# EAGLE design Adafruit MAX9814 (EAGLE 6.3)
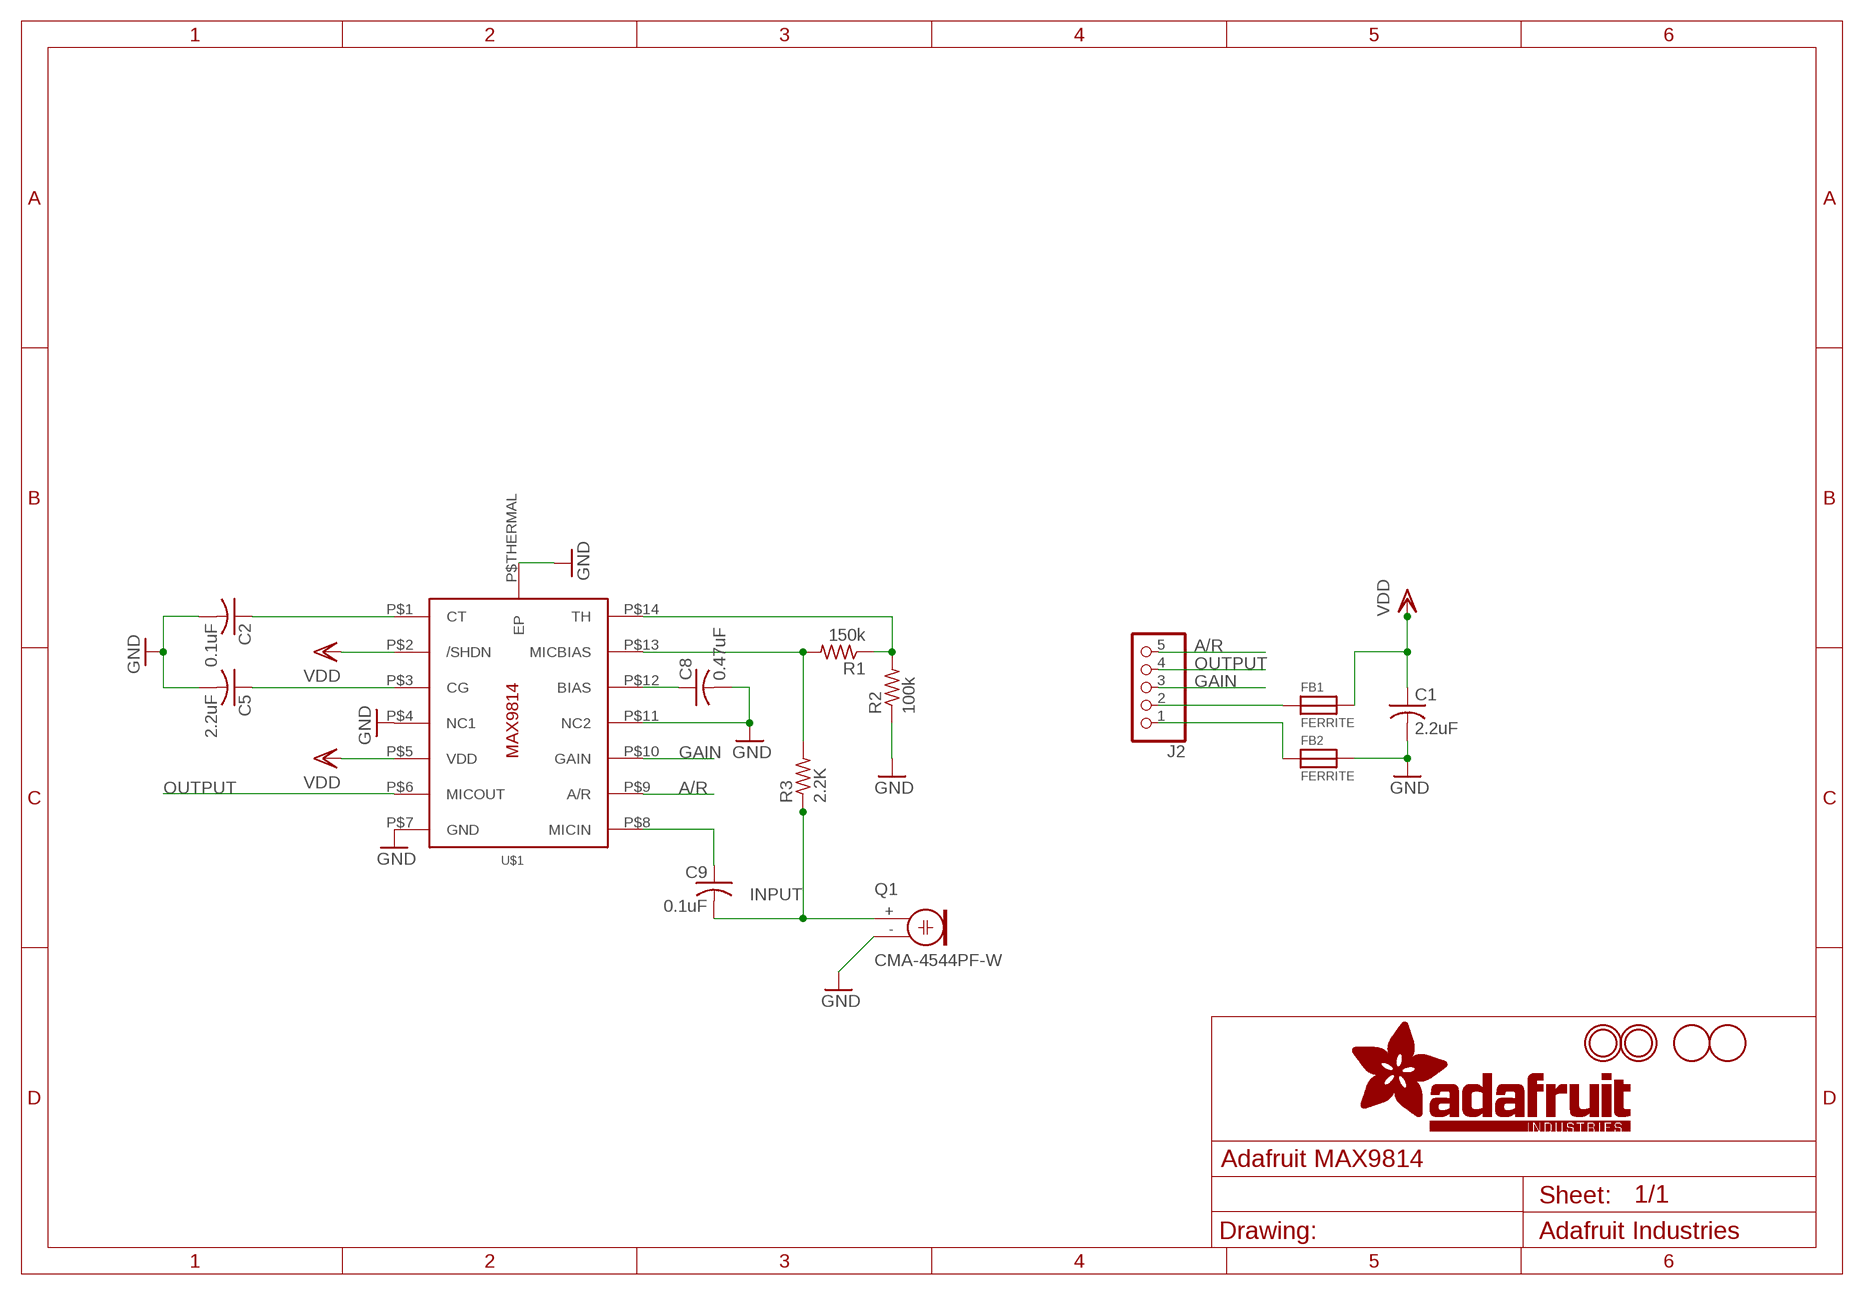
[diagram p0: schematic, sheet 1]

## Parts
C1  2.2uF  C-USC0805K  [C0805K]
C2  0.1uF  C-USC0805K  [C0805K]
C5  2.2uF  C-USC0805K  [C0805K]
C8  0.47uF  C-USC0805K  [C0805K]
C9  0.1uF  C-USC0805K  [C0805K]
FB1  FERRITE  FERRITE0805  [0805]
FB2  FERRITE  FERRITE0805  [0805]
J2  HEADER-1X576MIL  [1X05_ROUND_76]
Q1  CMA-4544PF-W  ELECTRET  [9.7ELECTRET]
R1  150k  R-US_R0805  [R0805]
R2  100k  R-US_R0805  [R0805]
R3  2.2K  R-US_R0805  [R0805]
U$1  MAX9814TDFN14  [TDFN14_3X3MM]
U$2  FIDUCIAL  [FIDUCIAL_1MM]
U$3  FIDUCIAL  [FIDUCIAL_1MM]
U$4  MOUNTINGHOLE2.0  [MOUNTINGHOLE_2.0_PLATED]
U$5  MOUNTINGHOLE2.0  [MOUNTINGHOLE_2.0_PLATED]

## Nets
A/R: J2.5 U$1.P$9(A/R)
GAIN: J2.3 U$1.P$10(GAIN)
GND: C1.2 C2.2 C5.2 C8.2 FB2.2 Q1.- R2.1 U$1.P$4(NC1) U$1.P$7(GND) U$1.P$11(NC2) U$1.P$THERMAL(EP)
INPUT: C9.2 Q1.+ R3.1
N$2: FB1.1 J2.2
N$3: FB2.1 J2.1
N$5: C9.1 U$1.P$8(MICIN)
N$7: C8.1 U$1.P$12(BIAS)
N$8: C2.1 U$1.P$1(CT)
N$9: C5.1 U$1.P$3(CG)
N$10: R1.1 R2.2 U$1.P$14(TH)
N$11: R1.2 R3.2 U$1.P$13(MICBIAS)
OUTPUT: J2.4 U$1.P$6(MICOUT)
VDD: C1.1 FB1.2 U$1.P$2(/SHDN) U$1.P$5(VDD)

## Library data of the parts
C1 C2 C5 C8 C9 = adafruit:C-US: CAPACITOR, American symbol
FB1 FB2 = microbuilder:FERRITE: Ferrite Bead 0603 MMZ1608B121C - 120 Ohm, 600mA Ferrite Chip - Digikey: 445-2164-1-ND BK1608HW121-T - 120 Ohm, 600mA Ferrite Chip - Digikey: 587-1876-2-ND
J2 = microbuilder:HEADER-1X5: PIN HEADER
Q1 = adafruit:ELECTRET: Electret microphone Thru hole 2.54mm spacing with 9.7mm diameter
R1-R3 = adafruit:R-US_: RESISTOR, American symbol
U$1 = adafruit:MAX9814
U$2 U$3 = adafruit:FIDUCIAL: For use by pick and place machines to calibrate the vision/machine, 1mm By microbuilder.eu
U$4 U$5 = microbuilder:MOUNTINGHOLE: Mounting Hole For #2 screws (0.086"/2.18mm width, 0.094"/2.4mm hole) use 2.5mm

## Board
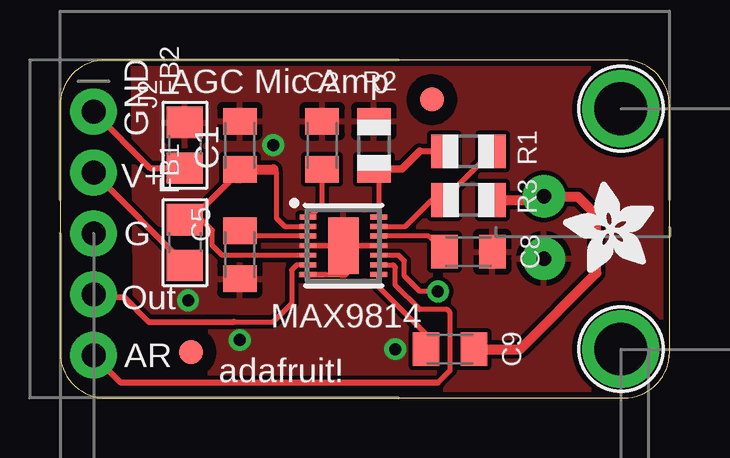
[diagram p1: board, top side]
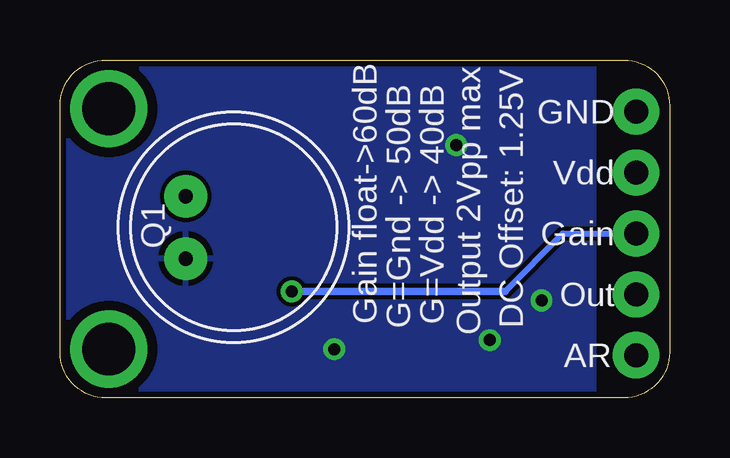
[diagram p2: board, bottom side, seen from below]

Size 25.4 x 14.1 mm. Coordinates in mm from the lower left corner, seen from the top.
Outline: 0,12.19 0,1.91 arc90 1.91,0 23.5,0 arc90 25.4,1.91 25.4,12.19 arc90 23.5,14.1 1.91,14.1 arc90 0,12.19
Copper layers (1*16): Top 0.035mm / dielectric 1.5mm / Bottom 0.035mm
Design rules "adafruit *": minimum track width 8mil, minimum drill 15.5mil, track to track 7mil, track to pad 7mil, pad to pad 7mil, via to via 7mil, smd to smd 7mil, copper to edge 10mil, drill to drill 8mil, minimum pad ring 10mil, minimum via ring 8mil, stop-mask expansion 4mil, vias tented up to drill 20mil, thermal gap 10mil

### Footprints (pad centres in the part's own frame; a part is rotated, then mirrored left to right if it is on the bottom)
C0805K = smd 1.1 x 1.4: 1 -1,0; 2 1,0
0805 = smd 1.3 x 1.5: 1 -0.95,0; 2 0.95,0
1X05_ROUND_76 = drill 1 pad 1.93: 1 -5.08,0; 2 -2.54,0; 3 0,0; 4 2.54,0; 5 5.08,0
9.7ELECTRET = drill 0.6 pad 1.778: + 1.3,2; - -1.3,2
R0805 = smd 1.1 x 1.4: 1 -1,0; 2 1,0
TDFN14_3X3MM = smd 0.7 x 0.2: P$1 -1.475,1.2; P$2 -1.475,0.8; P$3 -1.475,0.4; P$4 -1.475,0; P$5 -1.475,-0.4; P$6 -1.475,-0.8; P$7 -1.475,-1.2; P$8 1.475,-1.2; P$9 1.475,-0.8; P$10 1.475,-0.4; P$11 1.475,0; P$12 1.475,0.4; P$13 1.475,0.8; P$14 1.475,1.2 | smd 1.27 x 2.35: P$THERMAL 0,0
FIDUCIAL_1MM = smd 1 x 1: 1 0,0
MOUNTINGHOLE_2.0_PLATED = drill 2.2 pad 3: P$1 0,0

### Placement (x,y rotation side)
C1  7.49,10.54 90 top
C2  10.92,10.54 90 top
C5  7.49,5.97 270 top
C8  17.02,6.1 0 top
C9  16.26,2.03 0 top
FB1  5.21,6.48 90 top
FB2  5.21,10.54 90 top
J2  1.4,6.86 270 top
Q1  18.16,7.11 90 bottom
R1  17.02,10.29 0 top
R2  13.08,10.54 270 top
R3  17.02,8.26 180 top
U$1  11.81,6.35 0 top
U$2  5.46,1.91 0 top
U$3  15.49,12.45 0 top
U$4  23.37,12.06 0 top
U$5  23.37,2.03 0 top
U$6  [ADAFRUIT_3.5MM]  24.77,5.21 90 top

### Tracks (layer width: path | path; a pad name or v marks a point on that pad's centre or on a via)
A/R
  Top 0.203: 15.75,0.64 16.26,1.14 16.26,3.56 16.13,3.68 14.99,3.68 13.97,4.7 13.97,5.46 13.88,5.55 U$1.P$9
  Top 0.254: 15.75,0.64 2.54,0.64 J2.5
GAIN  (via drill 0.5)
  Top 0.203: U$1.P$10 14.12,5.95 14.35,5.71 14.35,5.08 14.99,4.45 v15.75,4.45
  Bottom 0.254: 6.86,4.45 4.45,6.86 J2.3
  Bottom 0.305: 6.86,4.45 v15.75,4.45
GND  (via drill 0.5)
  Top 0.203: U$1.P$4 11.94,6.35 | 11.94,6.35 U$1.P$11 | U$1.P$7 11.94,5.15 11.94,6.35
  Top 0.406: 17.78,5.97 17.65,6.1 C8.2
  other vias: 7.49,2.41 8.89,10.54 13.97,2.03 5.33,4.06
  pour Top: 3.05,14.61 3.17,-0.13 23.85,-0.24 arc91 25.76,1.68 25.65,14.61
  pour Bottom: 3.17,14.61 3.17,-0.38 24.92,-0.26 arc90 25.91,1.25 25.91,14.61
INPUT
  Top 0.406: 17.53,2.03 C9.2 19.18,2.03 22.35,5.21 22.35,7.62 21.59,8.38 20.19,8.38 Q1.+ 20,8.26 R3.1
N$2
  Top 0.254: J2.2 5.27,5.53 FB1.1
N$3
  Top 0.254: J2.1 3.74,9.59 FB2.1
N$5
  Top 0.203: C9.1 15.26,2.68 15.24,2.67 13.29,4.62 U$1.P$8
N$7
  Top 0.203: U$1.P$12 15.36,6.75 C8.1
N$8
  Top 0.203: C2.1 10.92,8.06 10.41,7.55 U$1.P$1
N$9
  Top 0.203: U$1.P$3 7.91,6.75
  Top 0.254: C5.1 7.91,6.97 7.91,6.75
N$10
  Top 0.203: R2.2 12.97,9.54 12.95,9.53 13.31,9.17 13.29,9.14 U$1.P$14
  Top 0.254: 14.99,10.29 R1.1
  Top 0.305: R2.2 14.24,9.54 14.99,10.29
N$11
  Top 0.203: U$1.P$13 14.39,7.15 15.49,8.26 R3.2 16.02,8.29 R1.2
OUTPUT
  Top 0.203: U$1.P$6 9.87,5.55 9.65,5.33 9.65,3.94 8.89,3.17 7.25,3.17
  Top 0.254: J2.4 1.52,4.19 2.67,4.19 3.68,3.17 7.25,3.17
VDD
  Top 0.203: U$1.P$2 9.36,7.15 9.02,7.49 9.02,9.4 8.89,9.53 8.87,9.54 | 9.38,5.95 U$1.P$5 6.75,5.95 6.35,6.35 6.35,6.99 5.68,7.65
  Top 0.254: FB1.2 5.21,7.37 5.4,7.37 5.68,7.65 7.49,9.46 C1.1
  Top 0.406: 8.89,9.53 7.49,9.53 C1.1 7.49,9.17 7.34,9.17 7.24,9.27

### Text on the board
tPlace: AGC Mic Amp | GND | V+ | G | Out | MAX9814 | AR | adafruit!
bPlace: DC Offset: 1.25V | Output 2Vpp max | Gain float->60dB | G=Vdd -> 40dB | G=Gnd -> 50dB | GND | Vdd | Gain | Out | AR